# Altium project ECE453_DumptruckUltra_Board.PrjPcb (part 4 of 4)

## Sheet MCUDebug.SchDoc
size A; SheetNumber: 8; SheetTotal: 11
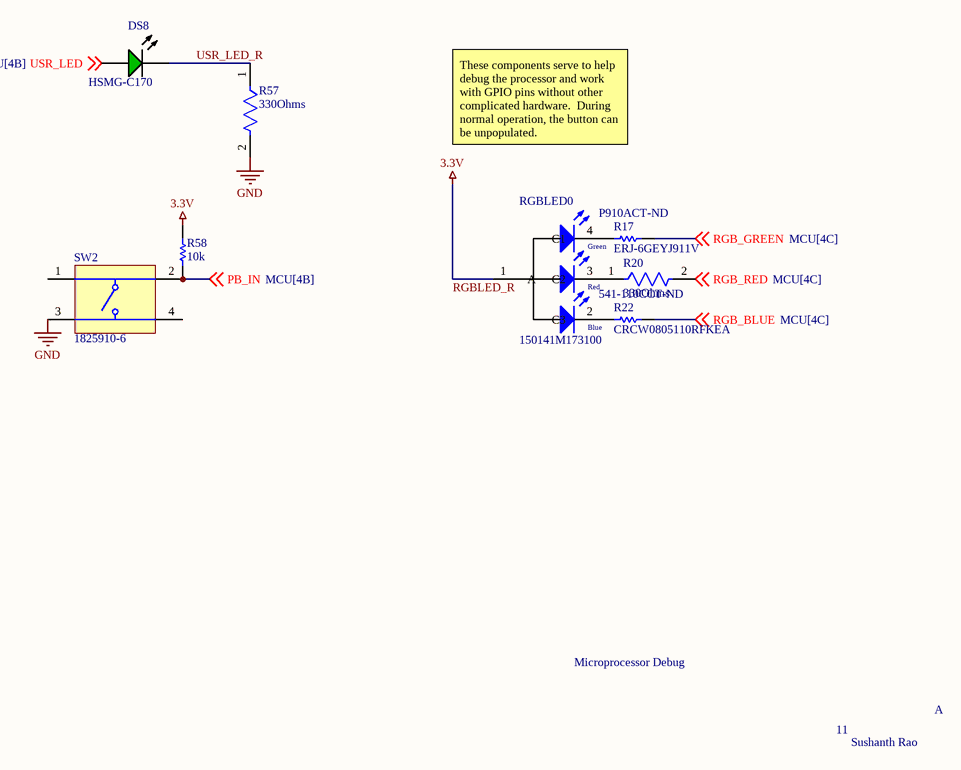
[diagram p7: MCUDebug.SchDoc]

### Parts
DS8  HSMG-C170  [AVAG-HSMX-C170_V]
R17  ERJ-6GEYJ911V  Supplier Part Number 1: P910ACT-ND  [RESC2013X70X40ML20T20]
R20  330Ohms  [FP-KTR10-IPC_C]
R22  CRCW0805110RFKEA  Supplier Part Number 1: 541-110CCT-ND  [RESC2013X50X30ML20T20]
R57  330Ohms  [FP-KTR10-IPC_C]
R58  10k  [RESC2013X60X35NL10T20]
RGBLED0  150141M173100  [3528_A]
SW2  1825910-6  [TECO-1825910-6_V]

### Nets
GND: R57.2 SW2.3
RGBLED_R: R58.2 RGBLED0.1(A)  [also labelled 3.3V]
PB_IN: R58.1 SW2.2 ; off-sheet PB_IN
RGB_BLUE: R22.2 ; off-sheet RGB_BLUE
RGB_GREEN: R17.2 ; off-sheet RGB_GREEN
RGB_RED: R20.2 ; off-sheet RGB_RED
USR_LED: DS8.1(A) ; off-sheet USR_LED
USR_LED_R: DS8.2(K) R57.1
NetR17_1: R17.1 RGBLED0.4(C1)
NetR20_1: R20.1 RGBLED0.3(C2)
NetR22_1: R22.1 RGBLED0.2(C3)

Not connected (* = marked no-connect by the designer): SW2 1 4

### Notes on the sheet
- These components serve to help debug the processor and work with GPIO pins without other complicated hardware.  During normal operation, the button can be unpopulated.
- Microprocessor Debug
- 11
- A
- Sushanth Rao
- (in symbol CMP-1431-00001-1) Green; Red; Blue

### Library data of the parts
DS8 = CMP-2000-05062-1: Chip LED, Green, 2.2 V, -40 to 85 degC, 2-Pin SMD, Pb-Free, Tape and Reel; Manufacturer: Avago; No. of Pins: 2; Peak Wavelength: 570nm; SVHC: NoSVHC(16-Jun-2014); Dominant Wavelength: 572nm; Forward Current If: 20mA; Viewing Angle: 170deg; Lens Shape: Rectangular; PIV Max: 5V; External Width: 1.25mm; LED Type: Standard; External Depth: 0.8mm; Opto Mounting Orientation: Top; Luminous Intensity: 15mcd; Luminous Intensity Min: 4mcd; Forward Voltage VF Max: 2.6V; External Length / Height: 2mm; Bulb Size: 1.25mmx1.4mm; Light Area Height: 1mm; Voltage Vf Typ: 2.2V; Operating Temperature Max: 85degC; Datasheet Version: Oct-08; MSL: MSL2A-4weeks; Peak Forward Current: 20mA; Package Description: 2-Pin Surface Mount Device, Body 2 x 1.25 mm, Height 0.8 mm; Datasheet URL: https://datasheet.ciiva.com/29280/180495-da-01-en-chip-led-hsmg-c170-gelb-gruen-29280971.pdf; Storage Temperature Min: -40degC; LED Colour: Green; Wavelength Typ: 570nm; Mounting Type: SMD; Forward Current If Max: 20mA; Dominant Wavelength Typ: 572nm; LED Mounting: SMD; Operating Temperature Range: -30degCto+85degC; Operating Temperature Min: -30degC; Manufacturer URL: http://www.avagotech.com/; Packaging: CutTape; Luminous Intensity Typ: 15mcd; Package Reference: HSMX-C170; Storage Temperature Max: 85degC; Opto Case Style: SMD; Forward Voltage: 2.2V
R17 = CMP-2001-00455-1: Manufacturer: Panasonic; Description: Fixed Resistor, Metal Glaze/thick Film, 0.125W, 910ohm, 150V, 5% +/-Tol, 200ppm/Cel, Surface Mount, 0805; Tolerance: 5%; Rated Power Dissipation (P): 125mW; Rated Temperature: 70°C; Resistance: 910R; Temperature Coefficient: 200ppm/°C; Working Voltage: 150V; Package Height: 0.6mm; Package Length: 2mm; Package Width: 1.25mm; Reference Standard: AEC-Q200; Part Number: ERJ-6GEYJ911V; Supplier 1: Digi-Key; Manufacturer Part Number: ERJ-6GEYJ911V; RoHS: Yes; Category: Chip SMD Resistors; Stock 1: 32792; Pricing 1: 1=0.10000, 10=0.06800, 100=0.02780, 1000=0.01251, 2500=0.01086 (USD); Mount: Surface Mount; Number of Pins: 2; Size Code: 0805; Terminal Finish: Nickel; Package Shape: Rectangular; Min Operating Temperature: -55°C; Max Operating Temperature: 155°C; JESD-609 Code: e3; Resistor Type: FIXED RESISTOR; Construction: Rectangular; Package Style: SMTMeter; Packaging: Tape and Reel; Technology: METAL GLAZE/THICK FILM; Termination: Wraparound; Reach SVHC Compliant: Yes; RoHS Compliant: Yes; ComponentLink1URL: https://datasheet.ciiva.com:443/pdfs/VipMasterIC/IC/PANA/PANA-S-A0009891627/PANA-S-A0009891627-1.pdf?src-supplier=IHS+Markit; ComponentLink1Description: https://datasheet.ciiva.com:443/pdfs/VipMasterIC/IC/PANA/PANA-S-A0009891627/PANA-S-A0009891627-1.pdf?src-supplier=IHS+Markit; ComponentLink2URL: https://datasheet.ciiva.com/11821/0900766b80f806dd-11821702.pdf?src-supplier=Rs; ComponentLink2Description: https://datasheet.ciiva.com/11821/0900766b80f806dd-11821702.pdf?src-supplier=Rs; ComponentLink3URL: https://datasheet.ciiva.com/43469/1678796-43469673.pdf?src-supplier=Farnell; ComponentLink3Description: https://datasheet.ciiva.com/43469/1678796-43469673.pdf?src-supplier=Farnell; ComponentLink4URL: https://datasheet.ciiva.com/46379/1678796-46379902.pdf?src-supplier=Element14; ComponentLink4Description: https://datasheet.ciiva.com/46379/1678796-46379902.pdf?src-supplier=Element14; ComponentLink5URL: https://datasheet.ciiva.com/24024/aoa0000ce1-37422-24024872.pdf?src-supplier=Mouser; ComponentLink5Description: https://datasheet.ciiva.com/24024/aoa0000ce1-37422-24024872.pdf?src-supplier=Mouser; ComponentLink6URL: https://datasheet.ciiva.com/9179/aoa0000ce1-9179466.pdf?src-supplier=Avnet; ComponentLink6Description: https://datasheet.ciiva.com/9179/aoa0000ce1-9179466.pdf?src-supplier=Avnet
R20 R57 = CMP-08839-031445-1: Res Thick Film 0805 300Ω 5% 0.125W ±200ppm/°C Automotive Paper T/R; Max Power Dissipation: 125mW; Resistance: 300R; Resistor Type: Thick Film; Case Code (Metric): 2012; Length: 0.079inch; Package Quantity: 1; Case Code (Imperial): 0805; Max Operating Temperature: 155°C; Number of Terminations: 2; Features: Automotive AEC-Q200; Temperature Coefficient: 200ppm/°C; Case/Package: 0805; Tolerance: 5%; Min Operating Temperature: -55°C; Packaging: Cut Tape; Height: 0.026inch; Series: KTR; RoHS Compliant: Yes; Width: 0.049inch
R22 = CMP-2001-04919-1: Manufacturer: Vishay Dale; Description: Fixed Resistor, Metal Glaze/thick Film, 0.125W, 110ohm, 150V, 1% +/-Tol, 100ppm/Cel, Surface Mount, 0805; Tolerance: 1%; Rated Power Dissipation (P): 125mW; Resistance: 110R; Temperature Coefficient: 100ppm/°C; Working Voltage: 150V; Rated Temperature: 70°C; Package Height: 0.45mm; Package Length: 2mm; Package Width: 1.25mm; Reference Standard: AEC-Q200; Part Number: CRCW0805110RFKEA; Supplier 1: Digi-Key; Manufacturer Part Number: CRCW0805110RFKEA; RoHS: Yes; Category: Chip SMD Resistors; Stock 1: 6355; Pricing 1: 1=0.10000, 10=0.06700, 100=0.02710, 1000=0.01219, 2500=0.01058 (USD); Mount: Surface Mount; Number of Pins: 2; Size Code: 0805; Terminal Finish: Nickel; Package Shape: Rectangular; Min Operating Temperature: -55°C; Max Operating Temperature: 155°C; Resistor Type: FIXED RESISTOR; Packaging: Tape and Reel; Construction: Chip; Package Style: SMTMeter; Technology: METAL GLAZE/THICK FILM; Termination: Wraparound; JESD-609 Code: e3; RoHS Compliant: Yes; Reach SVHC Compliant: Yes; ComponentLink1URL: https://datasheet.ciiva.com:443/pdfs/VipMasterIC/IC/VISH/VISH-S-A0007266705/VISH-S-A0007266705-1.pdf?src-supplier=IHS+Markit; ComponentLink1Description: https://datasheet.ciiva.com:443/pdfs/VipMasterIC/IC/VISH/VISH-S-A0007266705/VISH-S-A0007266705-1.pdf?src-supplier=IHS+Markit; ComponentLink2URL: https://datasheet.ciiva.com/11810/0900766b80d98b26-11810458.pdf?src-supplier=Rs; ComponentLink2Description: https://datasheet.ciiva.com/11810/0900766b80d98b26-11810458.pdf?src-supplier=Rs; ComponentLink3URL: https://datasheet.ciiva.com/2467/dcrcwe3-2467311.pdf?src-supplier=Digi-Key; ComponentLink3Description: https://datasheet.ciiva.com/2467/dcrcwe3-2467311.pdf?src-supplier=Digi-Key; ComponentLink4URL: https://datasheet.ciiva.com/2467/dcrcwe3-2467312.pdf?src-supplier=Digi-Key; ComponentLink4Description: https://datasheet.ciiva.com/2467/dcrcwe3-2467312.pdf?src-supplier=Digi-Key; ComponentLink5URL: https://datasheet.ciiva.com/2467/dcrcwe3-2467313.pdf?src-supplier=Digi-Key; ComponentLink5Description: https://datasheet.ciiva.com/2467/dcrcwe3-2467313.pdf?src-supplier=Digi-Key; ComponentLink6URL: https://datasheet.ciiva.com/26317/fld-crcw-e3-data-en-26317333.pdf?src-supplier=Distrelec; ComponentLink6Description: https://datasheet.ciiva.com/26317/fld-crcw-e3-data-en-26317333.pdf?src-supplier=Distrelec; ComponentLink7URL: https://datasheet.ciiva.com/5544/dcrcwe3-109170-5544341.pdf?src-supplier=Mouser; ComponentLink7Description: https://datasheet.ciiva.com/5544/dcrcwe3-109170-5544341.pdf?src-supplier=Mouser; ComponentLink8URL: https://datasheet.ciiva.com/16427/dcrcw-16427135.pdf?src-supplier=Future+Electronics; ComponentLink8Description: https://datasheet.ciiva.com/16427/dcrcw-16427135.pdf?src-supplier=Future+Electronics; ComponentLink9URL: https://datasheet.ciiva.com/22707/1697337-22707370.pdf?src-supplier=Element14; ComponentLink9Description: https://datasheet.ciiva.com/22707/1697337-22707370.pdf?src-supplier=Element14
R58 = CMP-1659-00013-4: Chip Resistor, 10 KOhm, +/- 1%, 0.125 W, -55 to 155 degC, 0805 (2012 Metric), RoHS, Tape and Reel; Manufacturer: Yageo; Manufacturer Part Number: RC0805FR-0710KL; Voltage Rating: 150 V; Value: 10kR; Power Rating: 125mW; Temperature Coefficient: 100ppm/°C; Mount: Surface Mount; ComponentLink1Description: Manufacturer URL; ComponentLink2URL: http://www.yageo.com/documents/recent/PYu-RC_Group_51_RoHS_L_04.pdf; Pins: 2; Length: 2 mm; Min Operating Temperature: -55 degC; Height: 0.5 mm; Mounting Technology: Surface Mount; RoHSCompliant: true; REACH SVHC: No SVHC; ComponentLink1URL: http://www.yageo.com/; Max Operating Temperature: 155 degC; PackageReference: 0805; DatasheetVersion: Rev. 4, 02/2016; Package Quantity: 5000; Packaging: Tape and Reel; ComponentLink2Description: Datasheet; PackageDescription: 2-Pin Surface Mounted Device, Body 2 x 1.25 mm; Supplier 1: Digi-Key; Supplier Part Number 1: 311-10.0KCRCT-ND; RoHS: Yes; Category: Chip SMD Resistors; Stock 1: 11227289; Pricing 1: 1=0.10000, 10=0.03300, 100=0.01340, 1000=0.00602, 2500=0.00523 (USD); Case/Package: 0805; Case Code (Imperial): 0805; Case Code (Metric): 2012; Tolerance: 1%; Termination: SMD/SMT; Series: RC; Resistance Tolerance: 1%; Resistor Type: Thick Film; Number of Terminations: 2; Max Power Dissipation: 125mW; Construction: Rectangular; Technology: THICK FILM; Features: Moisture Resistant; Width: 0.049inch; Depth: 1.25mm; Lead Free: Lead Free; RoHS Compliant: Yes; Military Standard: Not
RGBLED0 = CMP-1431-00001-1: SMD Full-Color Top LED, WL-SFTW, Red & Green & Blue; Manufacturer: Wuerth Elektronik; PackageReference: 3528_A; PartNumber: 150141M173100; ComponentLink2Description: Datasheet; ComponentLink1URL: http://www.we-online.com; Color: Red & Green & Blue; ComponentLink1Description: Manufacturer URL; ComponentLink2URL: http://katalog.we-online.com/led/datasheet/150141M173100.pdf
SW2 = CMP-1684-00021-1: Tact Switch, SPST-NO, 0.05 A, -35 to 85 degC, 4-Pin THD, RoHS, Bulk; Manufacturer: TE Connectivity; Maximum Contact Resistance: 100mOhm; Mechanical Life: 100000Cycles; Bushing Type: Unthreaded; Switch Configuration: OFF(ON); Maximum DC Voltage Rating: 24V; Contact Rating @ Voltage: 0.05A@24VDC; Actuator Color: Black; Body Orientation: Straight; Function: MomentaryContact; Illumination: N/R; Actuator Style: RoundButton; Actuator Material: PolybutyleneTerephthalate; Dielectric Strength: 500VAC; Pole Throw Configuration: SPST; Actuator Length: 1.4mm; Product Weight: N/A; Contact Material: CopperAlloy; Housing Material: N/A; Terminal Type: PCPins; Minimum Insulation Resistance: 100MOhm; Package Description: 4-Pin Through Hole Device, Body 5.99 x 5.99 mm, Pitch 6.5 mm; Part No: 1825910-6; Package Reference: THD; Base Material: N/A; Manufacturer URL: http://www.te.com; Contact Plating: Silver; RoHS: Yes; Datasheet Version: Rev. C9; Electrical Life: 100000Cycles; Maximum AC Voltage Rating: N/A; Thread Size: N/R; Operating Temperature: -35to85C; Mounting: ThroughHole; Dimension: 5.99x5mm; Datasheet URL: http://www.te.com/commerce/DocumentDelivery/DDEController?Action=showdoc&DocId=Customer+Drawing%7F1825910%7FC9%7Fpdf%7FEnglish%7FENG_CD_1825910_C9.pdf%7F1825910-6; Family: 1825910; Seal Location: N/A; Seal Description: N/A; Packaging: N/A

## Sheet PressureSensor.SchDoc
size A; SheetNumber: 9; SheetTotal: 11
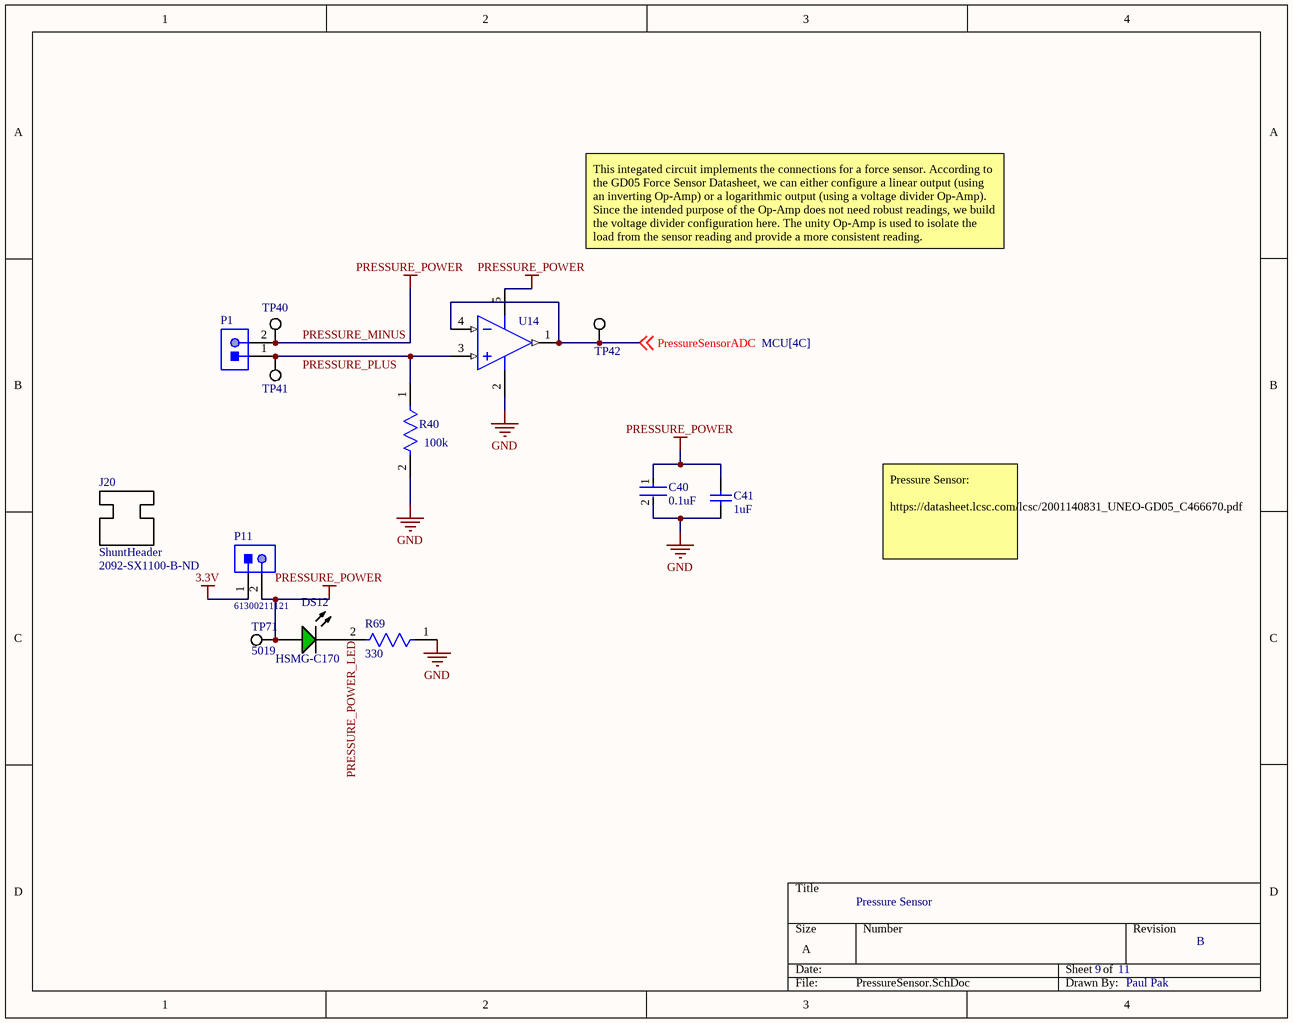
[diagram p8: PressureSensor.SchDoc]

### Parts
C40  0.1uF  [FP-CC0805-0_85-MFG]
C41  1uF  [CAPC2013X145X50ML20T25]
DS12  HSMG-C170  [AVAG-HSMX-C170_V]
J20  ShuntHeader  Supplier Part Number 1: 2092-SX1100-B-ND
P1  61300211121  [61300211121]  (value not drawn)
P11  61300211121  [61300211121]
R40  100k  [FP-ERA6A-IPC_B]
R69  330  [FP-CRCW0805-e3-MFG]
TP40  5019  [KSTN-5019_V]  (value not drawn)
TP41  5019  [KSTN-5019_V]  (value not drawn)
TP42  5019  [KSTN-5019_V]  (value not drawn)
TP71  5019  [KSTN-5019_V]
U14  LMV796QMF/NOPB  [DBV0005A_L]  (value not drawn)

### Nets
3.3V: P11.1  [project net RGBLED_R]
GND: C40.2 C41.1 R40.2 R69.1 U14.2(V-)
PRESSURE_MINUS: C40.1 C41.2 DS12.1(A) P1.2 P11.2 TP40.1 TP71.1 U14.5(V+)  [also labelled PRESSURE_POWER]
PRESSURE_PLUS: P1.1 R40.1 TP41.1 U14.3(IN+)
PRESSURE_POWER_LED: DS12.2(K) R69.2
PressureSensorADC: TP42.1 U14.1(OUT) U14.4(IN-) ; off-sheet PressureSensorADC

### Notes on the sheet
- This integated circuit implements the connections for a force sensor. According to the GD05 Force Sensor Datasheet, we can either configure a linear output (using an inverting Op-Amp) or a logarithmic output (using a voltage divider Op-Amp). Since the intended purpose of the Op-Amp does not need robust readings, we build the voltage divider configuration here. The unity Op-Amp is used to isolate the load from the sensor reading and provide a more consistent reading.
- Pressure Sensor:
  https://datasheet.lcsc.com/lcsc/2001140831_UNEO-GD05_C466670.pdf
- Pressure Sensor
- 11
- B
- Paul Pak

### Library data of the parts
C40 = CMP-1036-04410-2: CAP CER 0.1UF 25V X7R 0805; Manufacturer Part Number: CC0805KRX7R8BB104; Manufacturer: Yageo; Tolerance: 0.1; Material: Ceramic; Value: 100 nF; Insulation Resistance: 100GR; ComponentLink2URL: http://www.yageo.com/documents/recent/UPY-GPHC_Y5V_6.3V-to-50V_8.pdf; Category: Cap; Mouser Description: Multilayer Ceramic Capacitors MLCC - SMD/SMT 100nF 25V X7R 10%; Device Class L1: Passive Components; Footprint Url: http://www.yageo.com/exep/pages/download/literatures/UPY-C_GEN_24.pdf; Height: 0.95mm; Digikey Description: CAP CER 0.1UF 25V X7R 0805; Lead Free: Yes; Temperature Range High: +85°C; Temperature: -30°C to +85°C; Ipc Land Pattern Name: CAPC200125X85; Capacitance: 100 nF; Automotive: No; Octopart: https://octopart.com/cc0805krx7r8bb104-yageo-39467766; Device Class L2: Capacitors; Temperature Characteristic: X7R; Voltage Rating: 25 V; ComponentLink2Description: Datasheet; Temperature Range Low: -30°C; Device Class L3: Ceramic Capacitors; RoHS: TRUE; Package: CC0805-0.85; Supplier 1: Digi-Key; Supplier Part Number 1: 311-1141-1-ND; Stock 1: 1013369; Pricing 1: 1=0.11000, 10=0.07700, 50=0.04380, 100=0.03620, 500=0.02542, 1000=0.02104 (USD); Mount: Surface Mount; Case/Package: 0805; Number of Pins: 2; Case Code (Metric): 2012; Case Code (Imperial): 0805; Min Operating Temperature: -55°C; Max Operating Temperature: 125°C; Packaging: Tape and Reel; Voltage Rating (DC): 25V; Dielectric: X7R; Package Quantity: 4000; Termination: SMD/SMT; Series: CC; Resistor Type: Ceramic; Length: 2mm; Width: 1.25mm; Depth: 1.25mm; Thickness: 0.033inch; Radiation Hardening: No; RoHS Compliant: Yes; Reach SVHC Compliant: Yes; Halogen Free: Halogen Free; ComponentLink1URL: https://datasheet.ciiva.com/8034/70765-8034031.pdf?src-supplier=Element14; ComponentLink1Description: https://datasheet.ciiva.com/8034/70765-8034031.pdf?src-supplier=Element14; ComponentLink3URL: https://datasheet.ciiva.com/28450/1489800-28450789.pdf?src-supplier=Element14; ComponentLink3Description: https://datasheet.ciiva.com/28450/1489800-28450789.pdf?src-supplier=Element14; ComponentLink4URL: https://datasheet.ciiva.com/46430/1850775-46430166.pdf?src-supplier=Element14; ComponentLink4Description: https://datasheet.ciiva.com/46430/1850775-46430166.pdf?src-supplier=Element14; ComponentLink5URL: https://datasheet.ciiva.com/145/mlccorderingcode-145008.pdf?src-supplier=Digi-Key; ComponentLink5Description: https://datasheet.ciiva.com/145/mlccorderingcode-145008.pdf?src-supplier=Digi-Key; ComponentLink6URL: https://datasheet.ciiva.com/145/mlccorderingcode-145007.pdf?src-supplier=Digi-Key; ComponentLink6Description: https://datasheet.ciiva.com/145/mlccorderingcode-145007.pdf?src-supplier=Digi-Key; ComponentLink7URL: https://datasheet.ciiva.com/145/mlccorderingcode-145009.pdf?src-supplier=Digi-Key; ComponentLink7Description: https://datasheet.ciiva.com/145/mlccorderingcode-145009.pdf?src-supplier=Digi-Key; ComponentLink8URL: https://datasheet.ciiva.com/8034/1784427-8034030.pdf?src-supplier=Element14; ComponentLink8Description: https://datasheet.ciiva.com/8034/1784427-8034030.pdf?src-supplier=Element14
C41 = CMP-1036-04757-2: Part Number: CC0805ZRY5V8BB105; Manufacturer: Yageo; Voltage Rating: 25V; Tolerance: 80%; Dielectric: Y5V; Supplier 1: Digi-Key; Supplier Part Number 1: 311-1358-1-ND; Manufacturer Part Number: CC0805ZRY5V8BB105; RoHS: Yes; Category: Ceramic Capacitors; Stock 1: 286163; Pricing 1: 1=0.13000, 10=0.09000, 50=0.05100, 100=0.04230, 500=0.02966, 1000=0.02456 (USD); Mount: Surface Mount; Case/Package: 0805; Case Code (Metric): 2012; Case Code (Imperial): 0805; Weight: 0.000194oz; Min Operating Temperature: -30°C; Max Operating Temperature: 85°C; Package Quantity: 1; Capacitance: 1uF; Packaging: Tape and Reel; Voltage Rating (DC): 25V; Termination: SMD/SMT; Series: CC; Resistor Type: Ceramic; Length: 2mm; Width: 1.25mm; Height: 0.85mm; Thickness: 0.033inch; Depth: 1.25mm; Radiation Hardening: No; RoHS Compliant: Yes; Reach SVHC Compliant: Yes; Lead Free: Lead Free; Halogen Free: Halogen Free; ComponentLink1URL: https://datasheet.ciiva.com/144/mlccorderingcode-144703.pdf?src-supplier=Digi-Key; ComponentLink1Description: https://datasheet.ciiva.com/144/mlccorderingcode-144703.pdf?src-supplier=Digi-Key; ComponentLink2URL: https://datasheet.ciiva.com/26863/getdatasheetpartid-419810-26863011.pdf?src-supplier=Verical; ComponentLink2Description: https://datasheet.ciiva.com/26863/getdatasheetpartid-419810-26863011.pdf?src-supplier=Verical; ComponentLink3URL: https://datasheet.ciiva.com/28450/1132289-28450860.pdf?src-supplier=Element14; ComponentLink3Description: https://datasheet.ciiva.com/28450/1132289-28450860.pdf?src-supplier=Element14; ComponentLink4URL: https://datasheet.ciiva.com/144/mlccorderingcode-144704.pdf?src-supplier=Digi-Key; ComponentLink4Description: https://datasheet.ciiva.com/144/mlccorderingcode-144704.pdf?src-supplier=Digi-Key; ComponentLink5URL: https://datasheet.ciiva.com/144/mlccorderingcode-144705.pdf?src-supplier=Digi-Key; ComponentLink5Description: https://datasheet.ciiva.com/144/mlccorderingcode-144705.pdf?src-supplier=Digi-Key; ComponentLink6URL: https://datasheet.ciiva.com/13208/upy-gp-np0-16v-to-50v-8-13208251.pdf?src-supplier=Mouser; ComponentLink6Description: https://datasheet.ciiva.com/13208/upy-gp-np0-16v-to-50v-8-13208251.pdf?src-supplier=Mouser
DS12 = CMP-2000-05062-1: as DS8 on sheet MCUDebug; Operating Temperature Max: 85degC; Datasheet Version: Oct-08; MSL: MSL2A-4weeks; Peak Forward Current: 20mA; Package Description: 2-Pin Surface Mount Device, Body 2 x 1.25 mm, Height 0.8 mm; Datasheet URL: https://datasheet.ciiva.com/29280/180495-da-01-en-chip-led-hsmg-c170-gelb-gruen-29280971.pdf; Storage Temperature Min: -40degC; LED Colour: Green; Wavelength Typ: 570nm; Mounting Type: SMD; Forward Current If Max: 20mA; Dominant Wavelength Typ: 572nm; LED Mounting: SMD; Operating Temperature Range: -30degCto+85degC; Operating Temperature Min: -30degC; Manufacturer URL: http://www.avagotech.com/; Packaging: CutTape; Luminous Intensity Typ: 15mcd; Package Reference: HSMX-C170; Storage Temperature Max: 85degC; Opto Case Style: SMD; Forward Voltage: 2.2V
J20 = ShuntHeader: Conn Mini Shunt 2 POS 2.54mm Black Cable Mount; Manufacturer: Kycon; Manufacturer Part Number: SX1100-B; Current Rating: 3A; Number of Positions: 2; Insulation Resistance: 1GR; Supplier 1: Digi-Key; RoHS: Yes; Category: Headers and Wire Housings; Stock 1: 85316; Pricing 1: 1=0.10000, 10=0.06000, 25=0.04920, 50=0.04540, 100=0.04390, 250=0.03788, 500=0.03636, 1000=0.03182, 2500=0.02878 (USD); Contact Plating: Gold; Contact Material: Bronze; Housing Material: Thermoplastic; Min Operating Temperature: -55°C; Max Operating Temperature: 125°C; Number of Rows: 1; Contact Gender: Female; Packaging: Bulk; Pitch: 2.54mm; Flammability Rating: UL94 V-0; RoHS Compliant: Yes; ComponentLink1URL: http://www.mouser.com/ds/2/222/SX1100-B-461401.pdf?src-supplier=Mouser; ComponentLink1Description: http://www.mouser.com/ds/2/222/SX1100-B-461401.pdf?src-supplier=Mouser
P1 P11 = CMP-1712-00002-4: THT Vertical Pin Header WR-PHD, Pitch 2.54 mm, Single Row, 2 pins; Manufacturer: Wurth Elektronik; Rated Current: 3A; Gender: Male; Withstanding Voltage: 500VAC; Working Voltage: 250VAC; Pitch: 2.54mm; Contact Resistance: 20mOhm; Pin Number: 2; Voltage Rating: 250V; Connector Type: Male Pin; Mounting Technology: THT; Orientation: Vertical; Operating Temperature: -40to105degC; Packaging: Bag; Publisher: WurthElektronik; Datasheet URL: https://katalog.we-online.de/em/datasheet/6130xx11121.pdf; Manufacturer URL: http://www.we-online.de; Row Number: Single; Package Reference: 61300211121; Part Number: 61300211121; Supplier 1: Digi-Key; Supplier Part Number 1: 732-5315-ND; Manufacturer Part Number: 61300211121; RoHS: Yes; Category: Headers and Wire Housings; Pricing 1: 1=0.13000, 10=0.11300, 25=0.09400, 50=0.07900, 100=0.07100, 1000=0.06500 (USD); Contact Material: Copper Alloy,Copper; Contact Plating: Gold; Color: Black; Housing Material: PBT; Min Operating Temperature: -40°C; Max Operating Temperature: 125°C; Number of Rows: 1; Number of Positions: 2; Termination: Through Hole; Number of Contacts: 2; Series: WR-PHD; Contact Type: Male Pin; Current Rating: 3A; Contact Gender: Male; Contact Mating Length: 0.236inch; RoHS Compliant: Yes; Lead Free: Lead Free; ComponentLink1URL: https://datasheet.ciiva.com/13619/6130xx11121-48870-13619345.pdf?src-supplier=Mouser; ComponentLink1Description: https://datasheet.ciiva.com/13619/6130xx11121-48870-13619345.pdf?src-supplier=Mouser
  P1: Stock 1: 203321; Mount: Through Hole
  P11: Stock 1: 204500
R40 = CMP-2001-00583-2: RES 100K OHM 0.1% 1/8W 0805; Manufacturer: Panasonic; Manufacturer Part Number: ERA-6AEB104V; Max Power Dissipation: 125mW; Voltage Rating: 100V; Resistance: 100kR; Temperature Coefficient: 25ppm/°C; Resistance Tolerance: 0.1%; Resistor Type: Thin Film; Mount: Surface Mount; Package Quantity: 1; RoHS Compliant: Yes; Features: Automotive AEC-Q200; Termination: Solder; Contact Plating: Tin; Number of Pins: 2; Construction: Rectangular; Size Code: 0805; Case/Package: 0805; Military Standard: Not; Voltage Rating (DC): 100V; Max Operating Temperature: 155°C; REACH SVHC: No SVHC; Series: ERA-6A; Case Code (Metric): 2012; Number of Terminations: 2; Tolerance: 0.1%; Width: 1.25mm; Depth: 1.25mm; Lead Free: Lead Free; Radiation Hardening: No; Length: 2mm; Technology: METAL FILM; Power Rating: 125mW; Min Operating Temperature: -55°C; Height: 0.5mm; Case Code (Imperial): 0805; Packaging: Tape and Reel; Supplier 1: Digi-Key; Supplier Part Number 1: P100KDACT-ND; RoHS: Yes; Category: Chip SMD Resistors; Stock 1: 245000; Pricing 1: 1=0.36000, 10=0.30100, 100=0.11770, 500=0.07116, 1000=0.04927, 2500=0.04516 (USD); Reach SVHC Compliant: Yes; ComponentLink1URL: https://datasheet.ciiva.com/11811/0900766b80beefcc-11811258.pdf?src-supplier=Rs; ComponentLink1Description: https://datasheet.ciiva.com/11811/0900766b80beefcc-11811258.pdf?src-supplier=Rs; ComponentLink2URL: https://datasheet.ciiva.com/26335/453651-da-01-en-widerstand-0805-era-26335725.pdf?src-supplier=Conrad; ComponentLink2Description: https://datasheet.ciiva.com/26335/453651-da-01-en-widerstand-0805-era-26335725.pdf?src-supplier=Conrad; ComponentLink3URL: https://datasheet.ciiva.com/48425/era-eng-tds-48425749.pdf?src-supplier=Distrelec; ComponentLink3Description: https://datasheet.ciiva.com/48425/era-eng-tds-48425749.pdf?src-supplier=Distrelec; ComponentLink4URL: https://datasheet.ciiva.com/43457/485442-43457791.pdf?src-supplier=Farnell; ComponentLink4Description: https://datasheet.ciiva.com/43457/485442-43457791.pdf?src-supplier=Farnell; ComponentLink5URL: https://datasheet.ciiva.com/46438/485442-46438215.pdf?src-supplier=Element14; ComponentLink5Description: https://datasheet.ciiva.com/46438/485442-46438215.pdf?src-supplier=Element14; ComponentLink6URL: https://datasheet.ciiva.com/22758/485442-22758155.pdf?src-supplier=Farnell; ComponentLink6Description: https://datasheet.ciiva.com/22758/485442-22758155.pdf?src-supplier=Farnell; ComponentLink7URL: https://datasheet.ciiva.com/16763/70068849-16763132.pdf?src-supplier=Allied+Electronics; ComponentLink7Description: https://datasheet.ciiva.com/16763/70068849-16763132.pdf?src-supplier=Allied+Electronics; ComponentLink8URL: https://datasheet.ciiva.com/16768/70068849-16768795.pdf?src-supplier=Allied+Electronics; ComponentLink8Description: https://datasheet.ciiva.com/16768/70068849-16768795.pdf?src-supplier=Allied+Electronics; ComponentLink9URL: https://datasheet.ciiva.com/9186/aoa0000ce26-9186703.pdf?src-supplier=Avnet; ComponentLink9Description: https://datasheet.ciiva.com/9186/aoa0000ce26-9186703.pdf?src-supplier=Avnet; ComponentLink10URL: https://datasheet.ciiva.com/16396/aoa0000ce26-16396829.pdf?src-supplier=Future+Electronics; ComponentLink10Description: https://datasheet.ciiva.com/16396/aoa0000ce26-16396829.pdf?src-supplier=Future+Electronics; ComponentLink11URL: https://datasheet.ciiva.com/46438/485442-46438216.pdf?src-supplier=Element14; ComponentLink11Description: https://datasheet.ciiva.com/46438/485442-46438216.pdf?src-supplier=Element14; ComponentLink12URL: https://datasheet.ciiva.com/22758/485442-22758153.pdf?src-supplier=Farnell; ComponentLink12Description: https://datasheet.ciiva.com/22758/485442-22758153.pdf?src-supplier=Farnell; ComponentLink13URL: https://datasheet.ciiva.com/46438/485442-46438217.pdf?src-supplier=Element14; ComponentLink13Description: https://datasheet.ciiva.com/46438/485442-46438217.pdf?src-supplier=Element14; ComponentLink14URL: https://datasheet.ciiva.com/48529/era-eng-tds-48529996.pdf?src-supplier=Distrelec; ComponentLink14Description: https://datasheet.ciiva.com/48529/era-eng-tds-48529996.pdf?src-supplier=Distrelec
R69 = CMP-2001-03823-2: RES Thick Film, 330Ω, 1%, 0.125W, 100ppm/°C, 0805; Manufacturer: Vishay; Manufacturer Part Number: CRCW0805330RFKEA; Voltage Rating (DC): 150V; Resistance: 330R; Max Power Dissipation: 125mW; Mount: Surface Mount; Packaging: Tape and Reel; Min Operating Temperature: -55°C; Military Standard: Not; Case Code (Metric): 2012; Height: 0.02inch; Voltage Rating: 150V; Case/Package: 0805; Max Operating Temperature: 155°C; Width: 0.049inch; Case Code (Imperial): 0805; Termination: SMD/SMT; Lead Free: Lead Free; Contact Plating: Tin; Package Quantity: 10; Composition: Thick Film; Length: 2mm; Features: Automotive AEC-Q200; Depth: 1.25mm; Weight: 0.000194oz; Tolerance: 1%; Power Rating: 125mW; Number of Terminations: 2; Temperature Coefficient: 100ppm/°C; Supplier 1: Digi-Key; Supplier Part Number 1: 541-330CCT-ND; RoHS: Yes; Category: Chip SMD Resistors; Stock 1: 1889; Pricing 1: 1=0.10000, 10=0.06700, 100=0.02710, 1000=0.01219, 2500=0.01058 (USD); Size Code: 0805; Series: CRCW; Resistor Type: Thick Film; Construction: Rectangular; Resistance Tolerance: 1%; Ratings: AEC-Q200; RoHS Compliant: Yes; ComponentLink1URL: https://datasheet.ciiva.com/8944/dcrcwe3-8944773.pdf?src-supplier=Avnet; ComponentLink1Description: https://datasheet.ciiva.com/8944/dcrcwe3-8944773.pdf?src-supplier=Avnet; ComponentLink2URL: https://datasheet.ciiva.com/8944/dcrcwe3-8944776.pdf?src-supplier=Avnet; ComponentLink2Description: https://datasheet.ciiva.com/8944/dcrcwe3-8944776.pdf?src-supplier=Avnet; ComponentLink3URL: https://datasheet.ciiva.com/2495/dcrcwe3-2495803.pdf?src-supplier=Digi-Key; ComponentLink3Description: https://datasheet.ciiva.com/2495/dcrcwe3-2495803.pdf?src-supplier=Digi-Key; ComponentLink4URL: https://datasheet.ciiva.com/2495/dcrcwe3-2495804.pdf?src-supplier=Digi-Key; ComponentLink4Description: https://datasheet.ciiva.com/2495/dcrcwe3-2495804.pdf?src-supplier=Digi-Key; ComponentLink5URL: https://datasheet.ciiva.com/2495/dcrcwe3-2495805.pdf?src-supplier=Digi-Key; ComponentLink5Description: https://datasheet.ciiva.com/2495/dcrcwe3-2495805.pdf?src-supplier=Digi-Key; ComponentLink6URL: https://datasheet.ciiva.com/5545/dcrcwe3-109170-5545357.pdf?src-supplier=Mouser; ComponentLink6Description: https://datasheet.ciiva.com/5545/dcrcwe3-109170-5545357.pdf?src-supplier=Mouser; ComponentLink7URL: https://datasheet.ciiva.com/16769/70201119-16769852.pdf?src-supplier=Allied+Electronics; ComponentLink7Description: https://datasheet.ciiva.com/16769/70201119-16769852.pdf?src-supplier=Allied+Electronics; ComponentLink8URL: https://datasheet.ciiva.com/7777/1697337-7777390.pdf?src-supplier=Element14; ComponentLink8Description: https://datasheet.ciiva.com/7777/1697337-7777390.pdf?src-supplier=Element14; ComponentLink9URL: https://datasheet.ciiva.com/7777/1720486-7777573.pdf?src-supplier=Element14; ComponentLink9Description: https://datasheet.ciiva.com/7777/1720486-7777573.pdf?src-supplier=Element14
TP40-TP42 TP71 = CMP-1672-00008-1: Test Point, 1 Position SMD, RoHS, Tape and Reel; Manufacturer: Keystone Electronics; Body Material: Bronze; Plating: Silver; ComponentLink1Description: Manufacturer URL; Package Quantity: 1000; DatasheetVersion: 03/2014; Packaging: Tape and Reel; ComponentLink2URL: http://www.keyelco.com/product-pdf.cfm?p=1357; ComponentLink1URL: http://www.keyelco.com/; Mount: Surface Mount; Contact Plating: Silver; PackageDescription: 1-Pin Surface Mount Device, Body 3.81 x 2.03 mm; Pins: 1; RoHSCompliant: True; Mounting Technology: Surface Mount; ComponentLink2Description: Datasheet; PackageReference: 5019; Supplier 1: Digi-Key; Supplier Part Number 1: 36-5019CT-ND; Manufacturer Part Number: 5019; RoHS: Yes; Category: Connectors; Stock 1: 1009631; Pricing 1: 1=0.34000, 25=0.27360, 100=0.22340, 250=0.20064, 500=0.19152 (USD); Number of Pins: 1; Material: Bronze; Contact Material: Bronze; Series: 5019; Termination: SMD/SMT; Height: 0.09inch; RoHS Compliant: Yes; Reach SVHC Compliant: Yes; Lead Free: Lead Free; ComponentLink3URL: https://datasheet.ciiva.com/16885/70182998-16885945.pdf?src-supplier=Allied+Electronics; ComponentLink3Description: https://datasheet.ciiva.com/16885/70182998-16885945.pdf?src-supplier=Allied+Electronics; ComponentLink4URL: https://datasheet.ciiva.com/14848/m60-2p61-14848437.pdf?src-supplier=Digi-Key; ComponentLink4Description: https://datasheet.ciiva.com/14848/m60-2p61-14848437.pdf?src-supplier=Digi-Key; ComponentLink5URL: https://datasheet.ciiva.com/14848/m60-2p61-14848438.pdf?src-supplier=Digi-Key; ComponentLink5Description: https://datasheet.ciiva.com/14848/m60-2p61-14848438.pdf?src-supplier=Digi-Key; ComponentLink6URL: https://datasheet.ciiva.com/14848/m60-2p61-14848439.pdf?src-supplier=Digi-Key; ComponentLink6Description: https://datasheet.ciiva.com/14848/m60-2p61-14848439.pdf?src-supplier=Digi-Key; ComponentLink7URL: https://datasheet.ciiva.com/16318/m60-2p61-16318395.pdf?src-supplier=Future+Electronics; ComponentLink7Description: https://datasheet.ciiva.com/16318/m60-2p61-16318395.pdf?src-supplier=Future+Electronics
U14 = CMP-0055-01622-2: 17 MHz, Low Noise, CMOS Input, 1.8V Operational Amplifier, Automotive Grade1, 5-pin SOT-23, Pb-Free; Manufacturer: Texas Instruments; PowerWise: N; PackageTopMarking: AD7A*XTT; CompType: Amplifiers; Max Supply Voltage: 5.5V; Number of Channels: 1; Input Offset Voltage (Vos): 1.35mV; Input Bias Current: 0.1pA; Gain Bandwidth Product: 17MHz; Power Supply Rejection Ratio (PSRR): 80dB; Slew Rate: 11.5V/µs; Voltage Gain: 110dB; Output Current per Channel: 60mA; Nominal Supply Current: 1.15mA; Amplifier Type: GENERAL PURPOSE; PackageDescription: Molded SOT-23, .115 x .063 x .040 in Body, 5 Lead, .0375 in Pitch; PinCount: 5; RoHS: Y; ComponentLink1URL: http://www.ti.com/general/docs/lit/getliterature.tsp?genericPartNumber=LMV796-Q1&fileType=pdf; ComponentLink1Description: Datasheet URL; Package Reference: DBV0005A; Supplier 1: Digi-Key; Supplier Part Number 1: LMV796QMF/NOPBCT-ND; Manufacturer Part Number: LMV796QMF/NOPB; Category: Amplifiers - Op Amps, Buffer, Instrumentation; Stock 1: 4981; Pricing 1: 1=2.14000, 10=1.92100, 25=1.81280, 100=1.54430, 250=1.45008, 500=1.26882 (USD); Mount: Surface Mount; Case/Package: SOT-23-5; Number of Pins: 5; Min Operating Temperature: -40°C; Max Operating Temperature: 125°C; Min Supply Voltage: 1.8V; Packaging: Tape and Reel; Package Quantity: 1; Number of Circuits: 1; Common Mode Rejection Ratio: 80dB; Number of Elements: 1; Operating Supply Current: 1.15mA; Series: PowerWise®; Supply Current: 1.15mA; Output Current: 60mA; Unity Gain Bandwidth Product: 17MHz; Radiation Hardening: No; RoHS Compliant: Yes; Lead Free: Lead Free; ComponentLink2URL: https://datasheet.ciiva.com/6627/lmv796-6627001.pdf?src-supplier=Digi-Key; ComponentLink2Description: https://datasheet.ciiva.com/6627/lmv796-6627001.pdf?src-supplier=Digi-Key; ComponentLink3URL: https://datasheet.ciiva.com/6627/lmv796-6627005.pdf?src-supplier=Digi-Key; ComponentLink3Description: https://datasheet.ciiva.com/6627/lmv796-6627005.pdf?src-supplier=Digi-Key; ComponentLink4URL: https://datasheet.ciiva.com/6626/lmv796-6626997.pdf?src-supplier=Digi-Key; ComponentLink4Description: https://datasheet.ciiva.com/6626/lmv796-6626997.pdf?src-supplier=Digi-Key

## Sheet UART.SchDoc
size A; SheetNumber: 10; SheetTotal: 11; ApprovedDate: 04/02/2019; AssemblyNumber: ECE315-F19
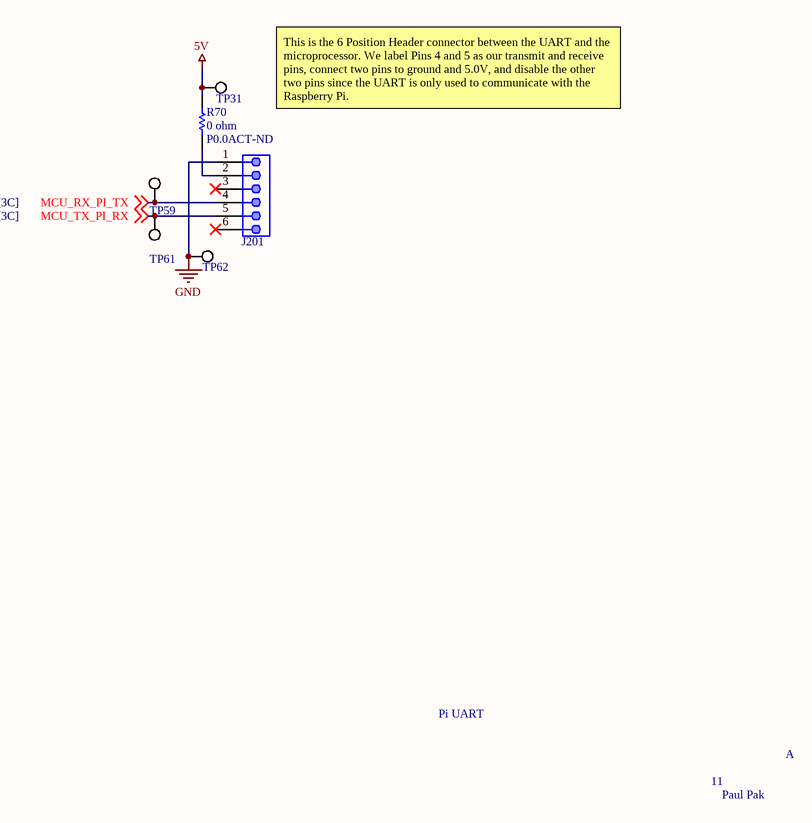
[diagram p9: UART.SchDoc]

### Parts
J201  (no value)  [HDR1X6]
R70  0 ohm  Supplier Part Number 1: P0.0ACT-ND  [RESC2013X70X40NL20T20]
TP31  5019  [KSTN-5019_V]  (value not drawn)
TP59  5019  [KSTN-5019_V]  (value not drawn)
TP61  5019  [KSTN-5019_V]  (value not drawn)
TP62  5019  [KSTN-5019_V]  (value not drawn)

### Nets
5V: R70.2 TP31.1
GND: J201.1 TP62.1
MCU_RX_PI_TX: J201.4 TP59.1 ; off-sheet MCU_RX_PI_TX
MCU_TX_PI_RX: J201.5 TP61.1 ; off-sheet MCU_TX_PI_RX
NetJ201_2: J201.2 R70.1

Not connected (* = marked no-connect by the designer): J201 3* 6*

### Notes on the sheet
- This is the 6 Position Header connector between the UART and the microprocessor. We label Pins 4 and 5 as our transmit and receive pins, connect two pins to ground and 5.0V, and disable the other two pins since the UART is only used to communicate with the Raspberry Pi.
- Pi UART
- 11
- A
- Paul Pak

### Library data of the parts
J201 = CONN_HEADER_MALE_1x6: Female, 6C, Rt Angle, .100"CC; 3.15mm Tail, No Mounting; PBT, Phos. Bronze, 105 C; Manufacturer 1: Sullins; Manufacturer Part Number 1: PPPC061LGBN-RC; Number of Positions: 6; Connector Type: Header; Pitch: 0.1inch; Supplier 1: Digi-Key; Supplier Part Number 1: S5481-ND; RoHS: Yes; Category: Connectors; Stock 1: 30480; Pricing 1: 1=0.66000, 10=0.56000, 80=0.50288, 440=0.41148, 1000=0.36576, 5000=0.33020 (USD); Mount: Through Hole; Color: Black; Contact Plating: Gold; Contact Material: Bronze; Housing Color: Black; Housing Material: Plastic; Package Quantity: 1000; Number of Rows: 1; Packaging: Bulk; Termination: Solder; Contact Type: Female Socket; Length: 15.7mm; Width: 8.5mm; Height: 2.4mm; Lead Free: Lead Free; RoHS Compliant: Yes; ComponentLink1URL: https://media.digikey.com/pdf/Data%20Sheets/Sullins%20PDFs/Female_Headers.100_DS.pdf?src-supplier=Digi-Key; ComponentLink1Description: https://media.digikey.com/pdf/Data%20Sheets/Sullins%20PDFs/Female_Headers.100_DS.pdf?src-supplier=Digi-Key; ComponentLink2URL: http://www.sullinscorp.com/catalogs/78_Page80-81_HEADER_.100_2.54mm_FEMALE.pdf?src-supplier=Future+Electronics; ComponentLink2Description: http://www.sullinscorp.com/catalogs/78_Page80-81_HEADER_.100_2.54mm_FEMALE.pdf?src-supplier=Future+Electronics
R70 = CMP-1665-00002-5: Chip Resistor, 0 Ohm, +/- 1%, 0.125 W, -55 to 155 degC, 0805 (2012 Metric), RoHS, Tape and Reel; PartNumber: ERJ-6GEY0R00V; Manufacturer: Panasonic; Tolerance: 5%; Value: 0R; Power Rating: 125mW; Temperature Coefficient: 600ppm/°C; Voltage Rating: 150V; Current Rating: 2A; REACH SVHC: No SVHC; Min Operating Temperature: -55 degC; Case/Package: 0805; Packaging: Tape and Reel; Package Quantity: 5000; ComponentLink1Description: Manufacturer URL; PackageDescription: 2-Pin Surface Mount Device, Body 2 x 1.25 mm; Mounting Technology: Surface Mount; Max Operating Temperature: 155 degC; Width: 1.25 mm; RoHSCompliant: True; Height: 0.6 mm; ComponentLink1URL: http://www.panasonic.com/; Resistance: 0 Ohm; ComponentLink2URL: http://industrial.panasonic.com/cdbs/www-data/pdf/RDA0000/AOA0000C84.pdf; Case Code (Imperial): 0805; DatasheetVersion: 03/2015; Length: 2 mm; Case Code (Metric): 2012; ComponentLink2Description: Datasheet; Radiation Hardening: No; Supplier 1: Digi-Key; Manufacturer Part Number: ERJ-6GEY0R00V; RoHS: Yes; Category: Chip SMD Resistors; Stock 1: 3172332; Pricing 1: 1=0.10000, 10=0.06400, 25=0.04680, 50=0.03560, 100=0.02620, 250=0.02000, 500=0.01598, 1000=0.01177 (USD); Contact Plating: Tin; Resistor Type: Thick Film; Series: ERJ; Termination: SMD/SMT; Number of Terminations: 2; Voltage Rating (DC): 150V; Construction: Rectangular; Max Power Dissipation: 125mW; Features: Automotive AEC-Q200; Technology: THICK FILM; Depth: 1.25mm; Ratings: AEC-Q200; RoHS Compliant: Yes; Lead Free: Lead Free; Military Standard: Not; Reach SVHC Compliant: Yes
TP31 TP59 TP61 TP62 = CMP-1672-00008-1: as TP40 on sheet PressureSensor; ComponentLink1Description: Manufacturer URL; Package Quantity: 1000; DatasheetVersion: 03/2014; Packaging: Tape and Reel; ComponentLink2URL: http://www.keyelco.com/product-pdf.cfm?p=1357; ComponentLink1URL: http://www.keyelco.com/; Mount: Surface Mount; Contact Plating: Silver; PackageDescription: 1-Pin Surface Mount Device, Body 3.81 x 2.03 mm; Pins: 1; RoHSCompliant: True; Mounting Technology: Surface Mount; ComponentLink2Description: Datasheet; PackageReference: 5019; Supplier 1: Digi-Key; Supplier Part Number 1: 36-5019CT-ND; Manufacturer Part Number: 5019; RoHS: Yes; Category: Connectors; Stock 1: 1009631; Pricing 1: 1=0.34000, 25=0.27360, 100=0.22340, 250=0.20064, 500=0.19152 (USD); Number of Pins: 1; Material: Bronze; Contact Material: Bronze; Series: 5019; Termination: SMD/SMT; Height: 0.09inch; RoHS Compliant: Yes; Reach SVHC Compliant: Yes; Lead Free: Lead Free; ComponentLink3URL: https://datasheet.ciiva.com/16885/70182998-16885945.pdf?src-supplier=Allied+Electronics; ComponentLink3Description: https://datasheet.ciiva.com/16885/70182998-16885945.pdf?src-supplier=Allied+Electronics; ComponentLink4URL: https://datasheet.ciiva.com/14848/m60-2p61-14848437.pdf?src-supplier=Digi-Key; ComponentLink4Description: https://datasheet.ciiva.com/14848/m60-2p61-14848437.pdf?src-supplier=Digi-Key; ComponentLink5URL: https://datasheet.ciiva.com/14848/m60-2p61-14848438.pdf?src-supplier=Digi-Key; ComponentLink5Description: https://datasheet.ciiva.com/14848/m60-2p61-14848438.pdf?src-supplier=Digi-Key; ComponentLink6URL: https://datasheet.ciiva.com/14848/m60-2p61-14848439.pdf?src-supplier=Digi-Key; ComponentLink6Description: https://datasheet.ciiva.com/14848/m60-2p61-14848439.pdf?src-supplier=Digi-Key; ComponentLink7URL: https://datasheet.ciiva.com/16318/m60-2p61-16318395.pdf?src-supplier=Future+Electronics; ComponentLink7Description: https://datasheet.ciiva.com/16318/m60-2p61-16318395.pdf?src-supplier=Future+Electronics

## Sheet USB_to_UART.SchDoc
size A; SheetNumber: 11; SheetTotal: 11
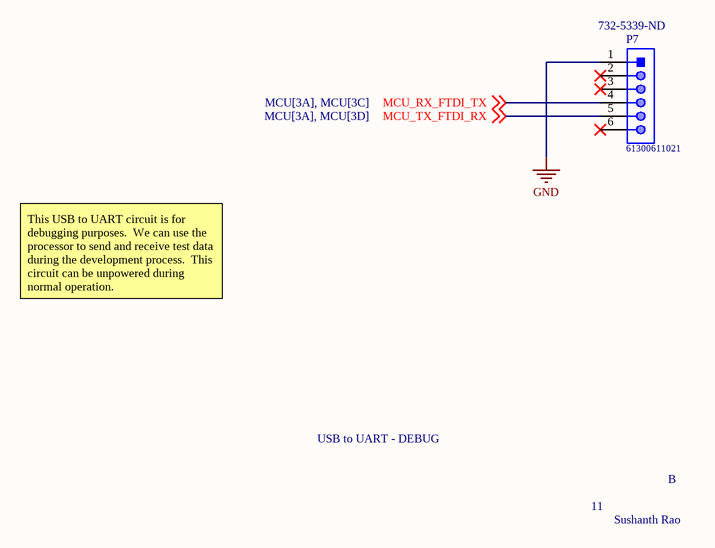
[diagram p10: USB_to_UART.SchDoc]

### Parts
P7  61300611021  Supplier Part Number 1: 732-5339-ND  [61300611021]

### Nets
GND: P7.1
MCU_RX_FTDI_TX: P7.4 ; off-sheet MCU_RX_FTDI_TX
MCU_TX_FTDI_RX: P7.5 ; off-sheet MCU_TX_FTDI_RX

Not connected (* = marked no-connect by the designer): P7 2* 3* 6*

### Notes on the sheet
- This USB to UART circuit is for debugging purposes.  We can use the processor to send and receive test data during the development process.  This circuit can be unpowered during normal operation.
- USB to UART - DEBUG
- 11
- B
- Sushanth Rao

### Library data of the parts
P7 = CMP-1502-01069-1: THT Angled Pin Header WR-PHD, Pitch 2.54 mm, Single Row, 6 pins; Manufacturer: Wurth Elektronik; Pin Number: 6; Gender: Male; Withstanding Voltage: 500VAC; Rated Current: 3A; Working Voltage: 250VAC; Contact Resistance: 20mOhm; Pitch: 2.54mm; Voltage Rating: 250V; Operating Temperature: -40to105degC; Package Reference: 61300611021; Packaging: Bag; Orientation: Angled; Manufacturer URL: http://www.we-online.de; Datasheet URL: https://katalog.we-online.de/em/datasheet/6130xx11021.pdf; Mounting Technology: THT; Publisher: WurthElektronik; Row Number: Single; Part Number: 61300611021; Supplier 1: Digi-Key; Manufacturer Part Number: 61300611021; RoHS: Yes; Category: Connectors; Stock 1: 9975; Pricing 1: 1=0.57000, 10=0.48400, 25=0.40400, 50=0.33700, 100=0.30600, 1000=0.27800 (USD); Contact Plating: Gold; Contact Material: Copper Alloy,Copper; Color: Black; Contact Shape: Square; Contact Finish - Mating: GOLD; Insulation Material: Nylon; Insulation Color: Black; Min Operating Temperature: -40°C; Max Operating Temperature: 125°C; Number of Rows: 1; Number of Positions: 6; Termination: Solder; Number of Contacts: 6; Connector Type: Header; Fastening Type: Pull; Series: WR-PHD; Contact Type: Male Pin; Contact Mating Length: 0.236inch; RoHS Compliant: Yes; Flammability Rating: UL94 V-0; ComponentLink1URL: https://datasheet.ciiva.com/28505/1442172-28505419.pdf?src-supplier=Element14; ComponentLink1Description: https://datasheet.ciiva.com/28505/1442172-28505419.pdf?src-supplier=Element14

## Nets that join several sheets
5V: PowerDistribution (7 pins), UART (R70.2 TP31.1)
6V: MotorDrivers (P5.1 P6.1), ServoDrivers (P8.1), PowerDistribution (7 pins)
GND: MotorDrivers (20 pins), ServoDrivers (15 pins), PowerDistribution (28 pins), DistanceSensor (J11.5 R66.1 TP37.1), IMU (R67.1 U10.3 U10.14), MCU (13 pins), MCUDebug (R57.2 SW2.3), PressureSensor (5 pins), UART (J201.1 TP62.1), USB_to_UART (P7.1)
RGBLED_R: MotorDrivers (P3.1 P4.1), PowerDistribution (7 pins), DistanceSensor (P9.1), IMU (P10.1), MCU (11 pins), MCUDebug (R58.2 RGBLED0.1), PressureSensor (P11.1)
3V3_GOOD: PowerDistribution (DS3.1 TP28.1 U8.1), MCU (U11.1)
DIST_INT: DistanceSensor (J11.2 TP35.1), MCU (R36.2)
I2C_SCL: DistanceSensor (J11.1 TP34.1), IMU (TP43.1 U10.4), MCU (R15.1 R32.2 TP54.1)
I2C_SDA: DistanceSensor (J11.3 TP36.1), IMU (TP46.1 U10.5), MCU (R14.1 R34.2 TP51.1)
IMU_INT: IMU (TP45.1 U10.8), MCU (R35.2)
M1_Backward: MotorDrivers (TP2.1 U1.2), MCU (R47.1)
M1_Forward: MotorDrivers (TP4.1 U1.3), MCU (R45.1)
M2_Backward: MotorDrivers (TP6.1 U2.2), MCU (R52.1)
M2_Forward: MotorDrivers (TP8.1 U2.3), MCU (R49.1)
MCU_RX_FTDI_TX: MCU (R53.1 TP47.1), USB_to_UART (P7.4)
MCU_RX_PI_TX: MCU (R42.1 TP50.1), UART (J201.4 TP59.1)
MCU_TX_FTDI_RX: MCU (R54.1 TP48.1), USB_to_UART (P7.5)
MCU_TX_PI_RX: MCU (R44.1 TP49.1), UART (J201.5 TP61.1)
PB_IN: MCU (R31.2), MCUDebug (R58.1 SW2.2)
PressureSensorADC: MCU (R43.2), PressureSensor (TP42.1 U14.1 U14.4)
RGB_BLUE: MCU (MD1.20), MCUDebug (R22.2)
RGB_GREEN: MCU (MD1.19), MCUDebug (R17.2)
RGB_RED: MCU (MD1.14), MCUDebug (R20.2)
Servo1_PWM: ServoDrivers (Q1.1 TP9.1), MCU (R37.2)
Servo2_PWM: ServoDrivers (Q3.1 TP13.1), MCU (R38.2)
Servo3_PWM: ServoDrivers (Q5.1 TP17.1), MCU (R41.2)
Servo4_PWM: ServoDrivers (Q7.1 TP21.1), MCU (R46.2)
Servo5_PWM: ServoDrivers (Q2.1 TP11.1), MCU (R48.2)
Servo6_PWM: ServoDrivers (Q4.1 TP15.1), MCU (R50.2)
Servo7_PWM: ServoDrivers (Q6.1 TP19.1), MCU (R51.1)
USR_LED: MCU (R30.2), MCUDebug (DS8.1)